# EAGLE design Chassis Board (EAGLE 9.1.3)
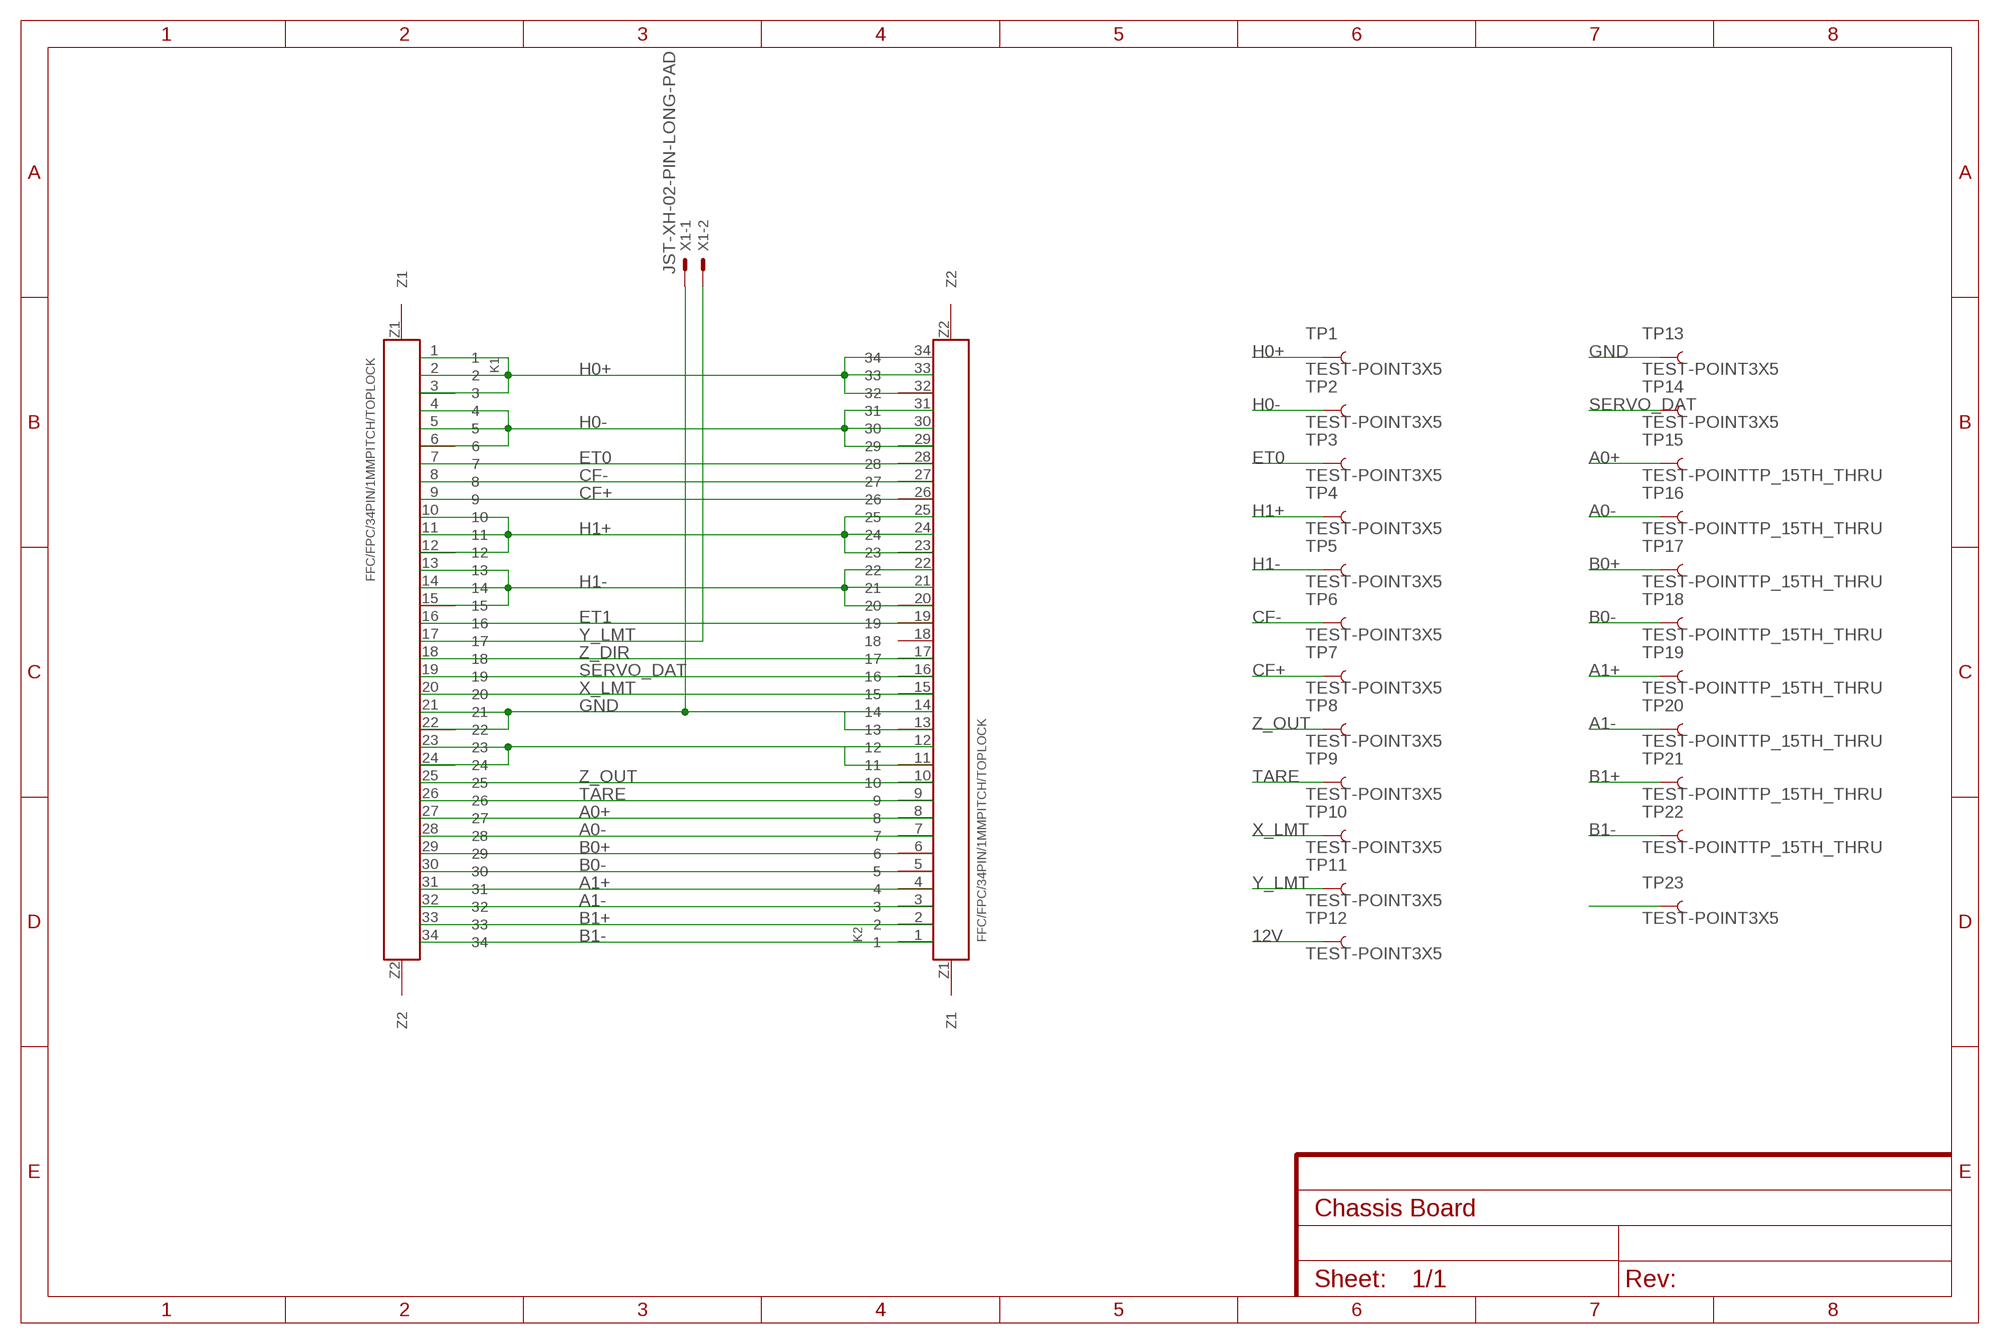
[diagram p0: schematic, sheet 1]

## Parts
K1  FFC/FPC/34PIN/1MMPITCH/TOPLOCK  [34PIN/1MMPITCH/FFC/FPC]
K2  FFC/FPC/34PIN/1MMPITCH/TOPLOCK  [34PIN/1MMPITCH/FFC/FPC]
TP1  TEST-POINT3X5  [PAD.03X.05]
TP2  TEST-POINT3X5  [PAD.03X.05]
TP3  TEST-POINT3X5  [PAD.03X.05]
TP4  TEST-POINT3X5  [PAD.03X.05]
TP5  TEST-POINT3X5  [PAD.03X.05]
TP6  TEST-POINT3X5  [PAD.03X.05]
TP7  TEST-POINT3X5  [PAD.03X.05]
TP8  TEST-POINT3X5  [PAD.03X.05]
TP9  TEST-POINT3X5  [PAD.03X.05]
TP10  TEST-POINT3X5  [PAD.03X.05]
TP11  TEST-POINT3X5  [PAD.03X.05]
TP12  TEST-POINT3X5  [PAD.03X.05]
TP13  TEST-POINT3X5  [PAD.03X.05]
TP14  TEST-POINT3X5  [PAD.03X.05]
TP15  TEST-POINTTP_15TH_THRU  [TP_15TH]
TP16  TEST-POINTTP_15TH_THRU  [TP_15TH]
TP17  TEST-POINTTP_15TH_THRU  [TP_15TH]
TP18  TEST-POINTTP_15TH_THRU  [TP_15TH]
TP19  TEST-POINTTP_15TH_THRU  [TP_15TH]
TP20  TEST-POINTTP_15TH_THRU  [TP_15TH]
TP21  TEST-POINTTP_15TH_THRU  [TP_15TH]
TP22  TEST-POINTTP_15TH_THRU  [TP_15TH]
TP23  TEST-POINT3X5  [PAD.03X.05]
X1  JST-XH-02-PIN-LONG-PAD  [JST-XH-02-PACKAGE-LONG-PAD]

## Nets
12V: K1.23 K1.24 K2.11 K2.12 TP12.P$1
A0+: K1.27 K2.8 TP15.P$1
A0-: K1.28 K2.7 TP16.P$1
A1+: K1.31 K2.4 TP19.P$1
A1-: K1.32 K2.3 TP20.P$1
B0+: K1.29 K2.6 TP17.P$1
B0-: K1.30 K2.5 TP18.P$1
B1+: K1.33 K2.2 TP21.P$1
B1-: K1.34 K2.1 TP22.P$1
CF+: K1.9 K2.26 TP7.P$1
CF-: K1.8 K2.27 TP6.P$1
ET0: K1.7 K2.28 TP3.P$1
ET1: K1.16 K2.19 TP23.P$1
GND: K1.21 K1.22 K2.13 K2.14 TP13.P$1 X1.1
H0+: K1.1 K1.2 K1.3 K2.32 K2.33 K2.34 TP1.P$1
H0-: K1.4 K1.5 K1.6 K2.29 K2.30 K2.31 TP2.P$1
H1+: K1.10 K1.11 K1.12 K2.23 K2.24 K2.25 TP4.P$1
H1-: K1.13 K1.14 K1.15 K2.20 K2.21 K2.22 TP5.P$1
SERVO_DAT: K1.19 K2.16 TP14.P$1
TARE: K1.26 K2.9 TP9.P$1
X_LMT: K1.20 K2.15 TP10.P$1
Y_LMT: K1.17 TP11.P$1 X1.2
Z_DIR: K1.18 K2.17
Z_OUT: K1.25 K2.10 TP8.P$1
Unconnected: K1.Z1 K1.Z2 K2.18 K2.Z1 K2.Z2

## Library data of the parts
K1 K2 = FracktalWorks_Eagle_Library:FFC/FPC/34PIN/1MMPITCH/TOPLOCK
TP1-TP23 = SparkFun-Connectors:TEST-POINT: SparkFun Test Points Bare copper test points for troubleshooting or In-Circuit-Testing. These are used by our Production team for verifying production board runs using pogo-pins on test beds. SparkFun Products: SparkFun LSM9DS1 Breakout <https://www.sparkfun.com/products/13284> SparkFun PSOC <https://www.sparkfun.com/products/13714> SparkFun Load Cell Amplifier <https://www.sparkfun.com/products/13879>
X1 = Rembrandt Electronics - JST XH Connectors v1-0:JST-XH-02-PIN: JST XH Connector 2 Pin Wire to board connector. Pitch: 2,54 mm, (0.100") Number of pins: 2 Created by Rembrandt Electronics www.rembrandtelectronics.com

## Board
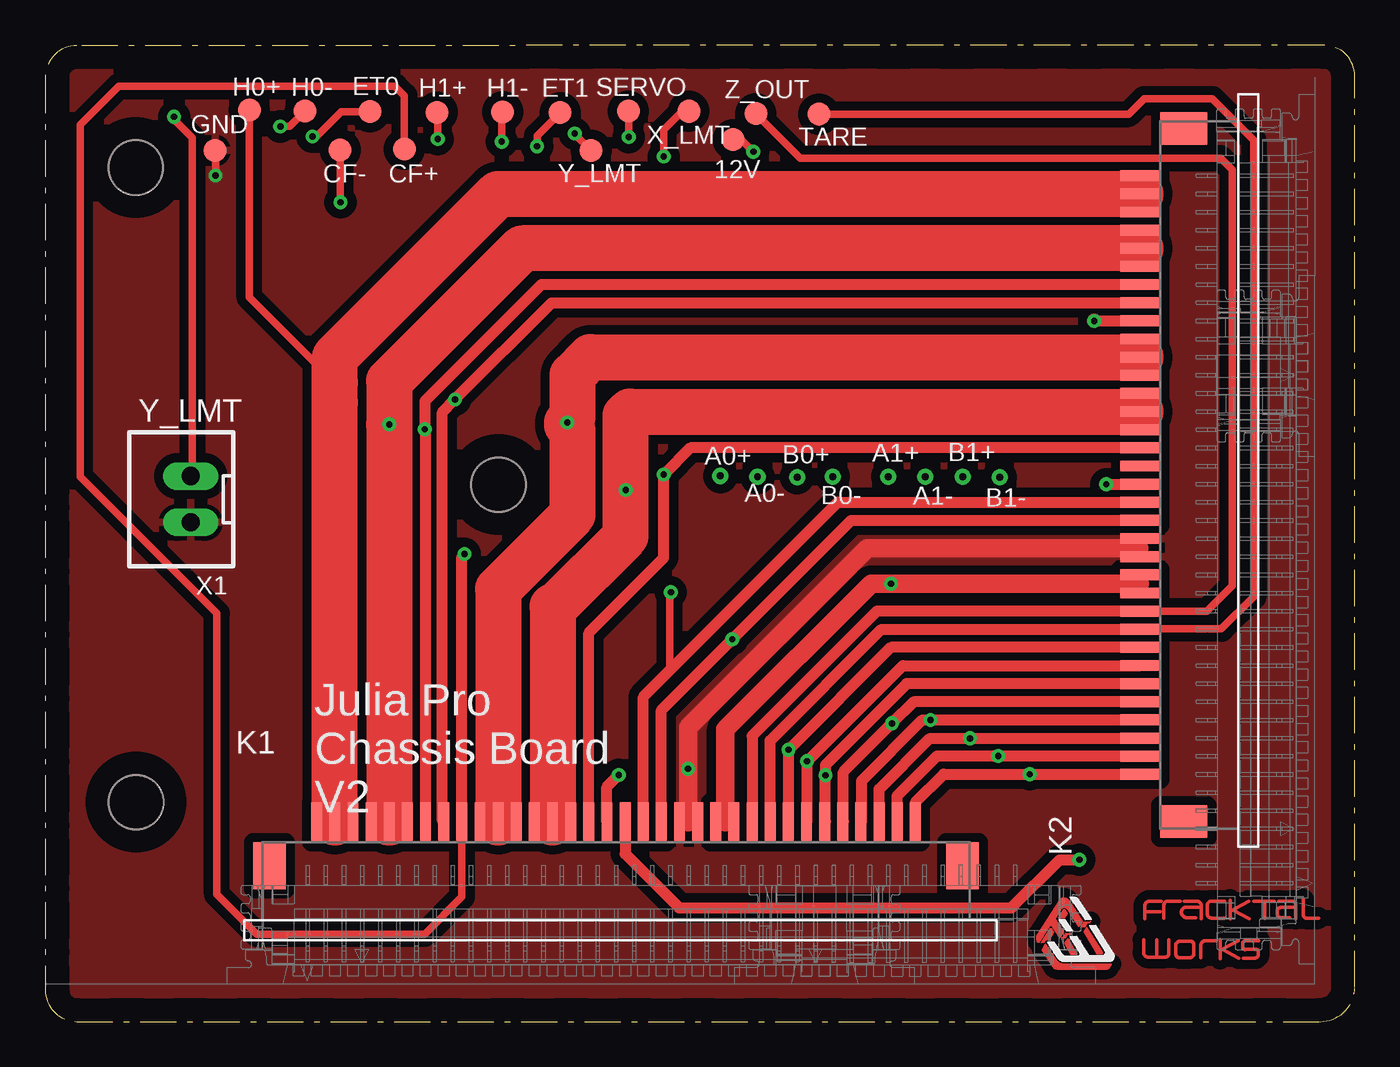
[diagram p1: board, top side]
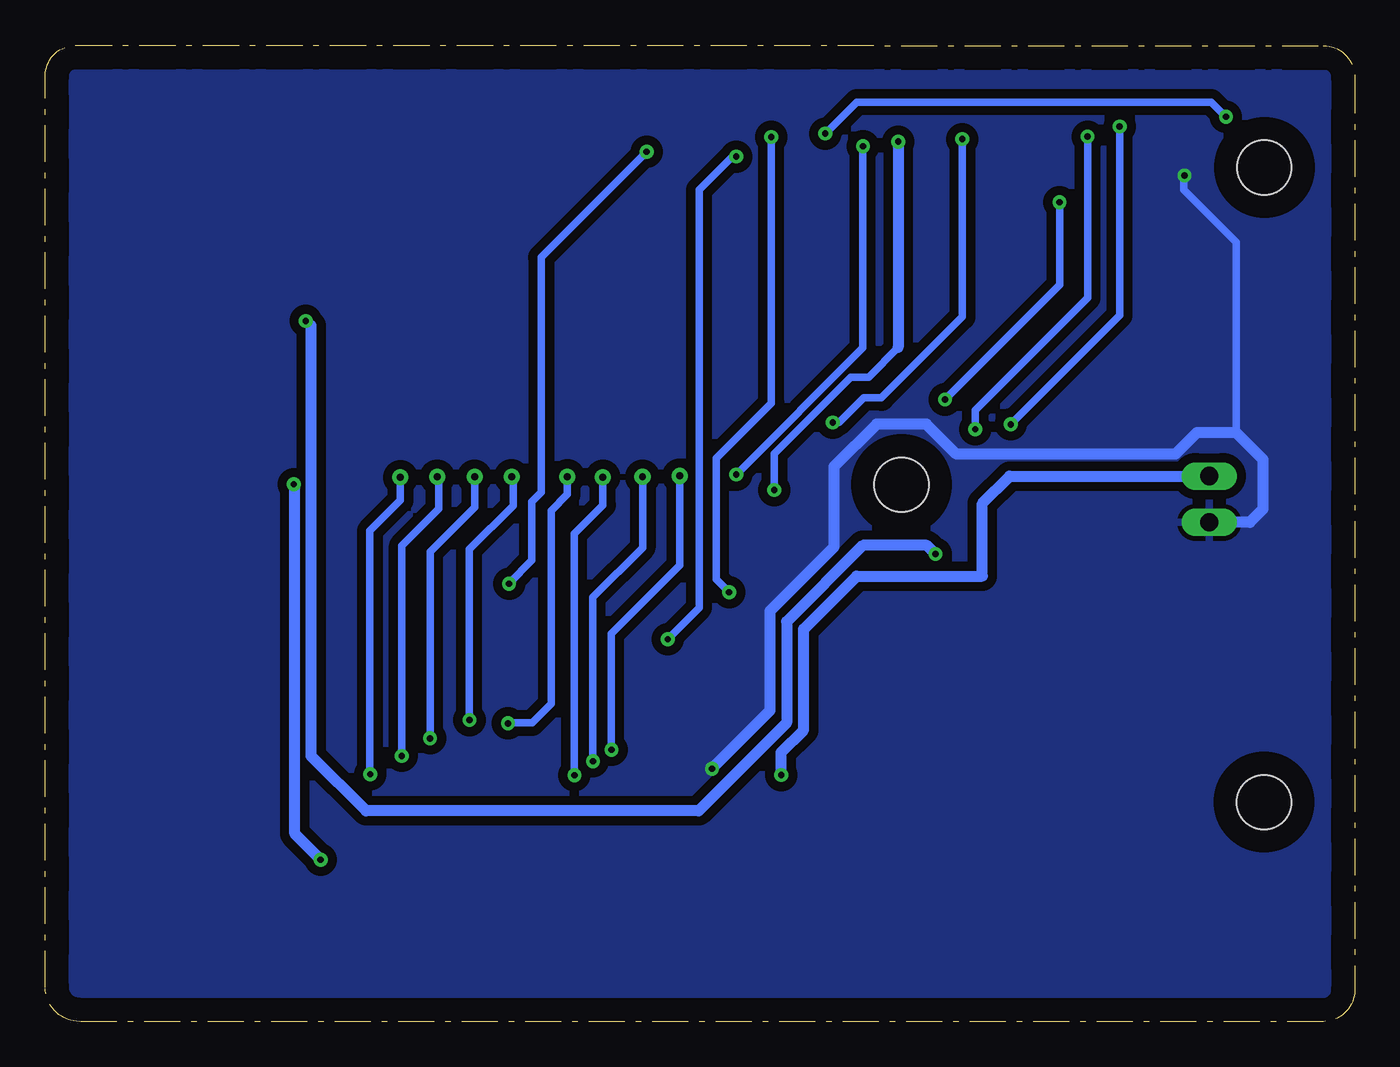
[diagram p2: board, bottom side, seen from below]

Size 72.17 x 53.81 mm. Coordinates in mm from the lower left corner, seen from the top.
Outline: 0,52.07 0,1.73 arc90 1.73,0 70.28,0 arc90 72.17,1.89 72.17,52.13 arc90 70.5,53.81 1.73,53.8 arc90 0,52.07
Copper layers (1*16): Top 0.035mm / dielectric 1.5mm / Bottom 0.035mm
Design rules "LionCircuits *": minimum track width 8mil, minimum drill 0.35mm, track to track 8mil, track to pad 8mil, pad to pad 8mil, via to via 8mil, smd to smd 8mil, copper to edge 50mil, drill to drill 10mil, minimum pad ring 10mil, minimum via ring 8mil, stop-mask expansion 4mil, vias tented up to drill 0mil, thermal gap 10mil
Holes 3 mm at 4.98,47.08 24.98,29.59 4.99,12.09

### Footprints (pad centres in the part's own frame; a part is rotated, then mirrored left to right if it is on the bottom)
34PIN/1MMPITCH/FFC/FPC = smd 0.6 x 2.2: 1 -14.43,2.1; 2 -13.43,2.1; 3 -12.43,2.1; 4 -11.43,2.1; 5 -10.43,2.1; 6 -9.43,2.1; 7 -8.43,2.1; 8 -7.43,2.1; 9 -6.43,2.1; 10 -5.43,2.1; 11 -4.43,2.1; 12 -3.43,2.1; 13 -2.43,2.1; 14 -1.43,2.1; 15 -0.43,2.1; 16 0.57,2.1; 17 1.57,2.1; 18 2.57,2.1; 19 3.57,2.1; 20 4.57,2.1; 21 5.57,2.1; 22 6.57,2.1; 23 7.57,2.1; 24 8.57,2.1; 25 9.57,2.1; 26 10.57,2.1; 27 11.57,2.1; 28 12.57,2.1; 29 13.57,2.1; 30 14.57,2.1; 31 15.57,2.1; 32 16.57,2.1; 33 17.57,2.1; 34 18.57,2.1 | smd 1.8 x 2.6: Z1 -17.03,-0.3; Z2 21.17,-0.3
PAD.03X.05 = smd 1.27 x 1.27: P$1 0,0
TP_15TH = drill 0.381 pad 0.61: P$1 0,0
JST-XH-02-PACKAGE-LONG-PAD = drill 1.016 long: 1 -1.27,0; 2 1.27,0

### Placement (x,y rotation side)
K1  29.39,8.88 0 top
K2  62.46,28.05 90 top
TP1  11.25,50.25 0 top
TP2  14.33,50.19 0 top
TP3  17.89,50.15 0 top
TP4  21.59,50.11 0 top
TP5  25.21,50.14 0 top
TP6  16.24,48.04 0 top
TP7  19.79,48.09 0 top
TP8  39.17,50.05 0 top
TP9  42.65,50.01 0 top
TP10  35.47,50.18 0 top
TP11  30.09,48.02 0 top
TP12  37.91,48.62 0 top
TP13  9.36,48.02 0 top
TP14  32.14,50.19 0 top
TP15  37.21,30.07 270 top
TP16  39.26,30.02 90 top
TP17  41.44,30.01 90 top
TP18  43.4,30.04 90 top
TP19  46.47,30.04 90 top
TP20  48.51,30.02 90 top
TP21  50.57,30.02 90 top
TP22  52.6,30 90 top
TP23  28.37,50.1 0 top
U$1  FWLOGO_SMALL_FOOTPRINT  [FWLOGO_SMALL]  54.39,1.71 0 top
X1  8.01,28.79 90 top

### Tracks (layer width: path | path; a pad name or v marks a point on that pad's centre or on a via)
12V  (via drill 0.35)
  Top 0.406: v39.03,47.94 38.35,48.62 TP12.P$1
  Top 0.61: K1.23 37.49,10.98 K1.24 | K2.12 60.36,24.1 K2.11
  Top 0.813: 60.33,24.13 60.36,24.1
  Top 1.016: 37.49,10.98 37.49,16.1 45.52,24.13 v46.61,24.13 60.33,24.13
  Bottom 0.406: v39.03,47.94 44.84,42.13 44.84,29.18 45.36,28.66 45.36,25.41 46.61,24.17 v46.61,24.13
A0+  (via drill 0.35)
  Top 0.406: K1.27
  Top 0.61: K1.27 v40.97,14.98 46.61,20.62 K2.8
  Bottom 0.406: v40.97,14.98 40.97,21.38 37.2,25.15 37.2,30.06 TP15.P$1
A0-  (via drill 0.35)
  Top 0.406: K1.28 41.99,11.01
  Top 0.61: 41.99,11.01 v41.99,14.35 47.27,19.62 K2.7
  Bottom 0.406: v41.99,14.35 41.99,23.39 39.26,26.12 TP16.P$1
A1+  (via drill 0.35)
  Top 0.406: K1.31 44.99,11.01
  Top 0.61: 44.99,11.01 44.99,13.27 48.35,16.62 v48.79,16.62 K2.4
  Bottom 0.406: v48.79,16.62 48.79,26.02 46.38,28.44 46.38,29.95 TP19.P$1
A1-  (via drill 0.35)
  Top 0.61: K1.32 45.96,12.81 48.76,15.61 v50.97,15.61 60.34,15.61 K2.3
  Bottom 0.406: v50.97,15.61 50.97,25.9 48.51,28.35 TP20.P$1
B0+  (via drill 0.35)
  Top 0.406: K1.29 42.99,11.01 | v43.01,13.57 42.99,13.57
  Top 0.61: K2.6 47.48,18.62 42.99,14.14 42.99,13.75 42.99,13.57 42.99,11.01
  Bottom 0.406: TP17.P$1 41.44,28.46 43.02,26.88 43.02,13.59 v43.01,13.57
B0-  (via drill 0.35)
  Top 0.406: K1.30 43.99,11.01
  Top 0.61: 43.99,11.01 43.99,13.76 v46.67,16.44 47.86,17.62 K2.5
  Bottom 0.406: TP18.P$1 43.4,29.06 44.29,28.16 44.29,17.5 45.34,16.46 46.64,16.46 v46.67,16.44
B1+  (via drill 0.35)
  Top 0.61: K1.33 46.96,12.44 49.16,14.64 v52.53,14.64 60.34,14.64 K2.2
  Bottom 0.406: v52.53,14.64 52.53,26.23 50.5,28.26 50.5,29.95 TP21.P$1
B1-  (via drill 0.35)
  Top 0.61: K1.34 47.96,12.07 49.52,13.63 v54.27,13.63 K2.1
  Bottom 0.406: TP22.P$1 52.6,28.73 54.28,27.05 54.28,13.65 v54.27,13.63
CF+  (via drill 0.35)
  Top 0.406: K1.9 22.96,6.87 20.9,4.81 11.65,4.81 9.45,7.01 9.45,22.49 1.92,30.02 1.92,49.43 4.05,51.56 19.27,51.56 19.79,51.04 TP7.P$1
  Top 0.61: K1.9 22.96,25.62 v23.1,25.77 | v57.83,38.62 K2.26
  Top 0.813: v57.82,38.62 v57.83,38.62
  Bottom 0.61: v23.1,25.77 23.58,26.25 27.1,26.25 31.31,22.05 31.31,16.46 36.16,11.61 54.5,11.61 57.52,14.63 57.52,38.37 57.77,38.62 v57.82,38.62
CF-  (via drill 0.35)
  Top 0.406: v16.27,45.16 16.27,48.02 TP6.P$1
  Top 0.61: K2.27 60.35,39.61 27.9,39.61 v22.58,34.29 21.88,33.59 21.88,11.05 K1.8
  Bottom 0.406: v22.58,34.29 16.27,40.6 v16.27,45.16
ET0  (via drill 0.35)
  Top 0.406: TP3.P$1 16.31,50.15 14.94,48.78 v14.72,48.78
  Top 0.61: K2.28 27.34,40.62 20.92,34.2 v20.92,32.65 20.94,32.68 20.94,10.99 K1.7
  Bottom 0.406: v20.92,32.65 20.92,33.69 14.72,39.89 v14.72,48.78
ET1  (via drill 0.35)
  Top 0.406: v27.1,48.25 27.1,48.83 TP23.P$1
  Top 0.61: K1.16 29.96,21.42 34.09,25.55 v34.09,30.15 35.56,31.62 K2.19
  Bottom 0.406: v34.09,30.15 27.1,37.13 v27.1,48.25
GND  (via drill 0.35)
  Top 0.406: v9.39,46.63 9.39,47.99 TP13.P$1
  Top 0.61: K1.22 35.43,10.98 K1.21 | K2.14 60.36,26.14 K2.13
  Top 0.813: 60.31,26.09 60.36,26.14
  Top 1.016: 35.43,10.98 v35.43,13.93 35.43,16.22 45.3,26.09 60.31,26.09
  Bottom 0.406: 6.53,32.46 6.53,42.96 9.41,45.85 9.41,46.61 v9.39,46.63
  Bottom 0.61: v35.43,13.93 32.23,17.13 32.23,22.62 28.7,26.15 28.7,30.58 26.35,32.93 23.61,32.93 21.96,31.28 9.88,31.28 8.7,32.46 6.53,32.46 5.05,30.99 5.05,28.24 5.78,27.52 X1.1
  pour Top (isolate 0.508): 0.94,53.19 71.51,53.19 71.51,0.94 0.89,0.94 0.89,53.16
  pour Bottom (isolate 0.508): 0.93,53.02 71.51,53.02 71.51,1.02 0.91,1.02 0.91,53.02
H0+
  Top 0.406: 15.96,35.22 11.25,39.92 TP1.P$1
  Top 0.61: K1.3 K1.1 K1.2 | K2.34 K2.33 K2.32
  Top 2.54: K1.2 15.96,34.12 15.96,35.22 15.96,36.62 24.96,45.62 K2.33
H0-  (via drill 0.35)
  Top 0.406: v12.95,49.34 13.47,49.34 TP2.P$1
  Top 0.61: K1.6 K1.4 K1.5 | K2.31 K2.30 K2.29
  Top 2.54: K2.30 26.28,42.62 18.96,35.3 v18.96,32.92 K1.5
  Bottom 0.406: v18.96,32.92 12.95,38.92 v12.95,49.34
H1+  (via drill 0.35)
  Top 0.406: v21.63,48.64 21.63,50.08 TP4.P$1
  Top 0.61: K1.12 K1.10 K1.11 | K2.25 K2.24 K2.23
  Top 2.54: K1.11 24.96,23.83 29.07,27.95 29.07,32.58 28.77,32.88 v28.77,33.02 29.06,33.31 29.06,35.64 30.05,36.62 K2.24
  Bottom 0.406: v21.63,48.64 21.63,38.84 26.09,34.38 27.06,34.38 28.42,33.02 v28.77,33.02
H1-  (via drill 0.35)
  Top 0.406: v25.16,48.5 25.16,50.09 TP5.P$1
  Top 0.61: K1.15 27.97,10.98 K1.14 | K1.14 K1.13 | K2.22 K2.21 K2.20
  Top 2.54: K1.14 27.97,22.89 28.12,22.89 31.99,26.76 v31.99,29.3 31.99,33.4 32.21,33.62 K2.21
  Bottom 0.406: 25.16,37.16 26.8,35.52 27.77,35.52 31.99,31.31 v31.99,29.3
  Bottom 0.61: v25.16,48.5 25.16,37.16
SERVO_DAT  (via drill 0.35)
  Top 0.406: 34.43,19.36 34.43,23.61 v34.48,23.66 | v32.16,48.76 TP14.P$1
  Top 0.61: K2.16 43.69,28.62 34.43,19.36 32.97,17.9 32.97,11.51 32.97,10.99 K1.19
  Bottom 0.406: v34.48,23.66 35.19,24.37 35.19,31.05 32.16,34.09 v32.16,48.76
TARE
  Top 0.406: TP9.P$1 59.72,50.01 60.57,50.86 64.33,50.86 66.6,48.59 66.6,23.41 64.83,21.64 60.34,21.64 60.32,21.62
  Top 0.61: K1.26 39.96,15.48 46.09,21.62 60.32,21.62 60.33,21.62 K2.9
X_LMT  (via drill 0.35)
  Top 0.406: v34.09,47.68 34.09,49.15 35.12,50.18 TP10.P$1
  Top 0.61: K1.20 33.96,17.17 v37.87,21.08 44.41,27.62 K2.15
  Bottom 0.406: v37.87,21.08 36.13,22.81 36.13,45.85 34.3,47.68 v34.09,47.68
Y_LMT  (via drill 0.35)
  Top 0.406: TP11.P$1 29.18,48.92 v29.18,48.95 | v7.1,49.87 7.1,49.71 8.09,48.72 8.09,30.14 X1.2
  Top 0.61: K1.17 30.96,12.94 v31.61,13.59
  Bottom 0.406: v7.1,49.87 7.91,50.69 27.44,50.69 v29.18,48.95
  Bottom 0.61: v31.61,13.59 31.61,14.83 30.38,16.06 30.38,21.63 27.46,24.55 20.52,24.55 20.52,28.56 19.02,30.06 X1.2
Z_DIR  (via drill 0.35)
  Top 0.61: K1.18 31.96,9.24 34.94,6.26 53.25,6.26 55.91,8.92 v57,8.92 | v58.48,29.62 K2.17
  Bottom 0.61: v57,8.92 58.42,10.34 58.42,29.55 v58.48,29.62
Z_OUT
  Top 0.406: TP8.P$1 41.62,47.6 64.78,47.6 65.43,46.95 65.43,24.02 64.02,22.61 60.38,22.61 K2.10
  Top 0.61: K2.10 45.84,22.62 38.96,15.75 K1.25

### Text on the board
tPlace: H0+ | H0- | ET0 | H1+ | H1- | ET1 | SERVO | Z_OUT | GND | X_LMT | TARE | CF- | CF+ | Y_LMT | 12V | Y_LMT | A0+ | B0+ | A1+ | B1+ | A0- | B0- | A1- | B1- | Julia Pro / Chassis Board / V2